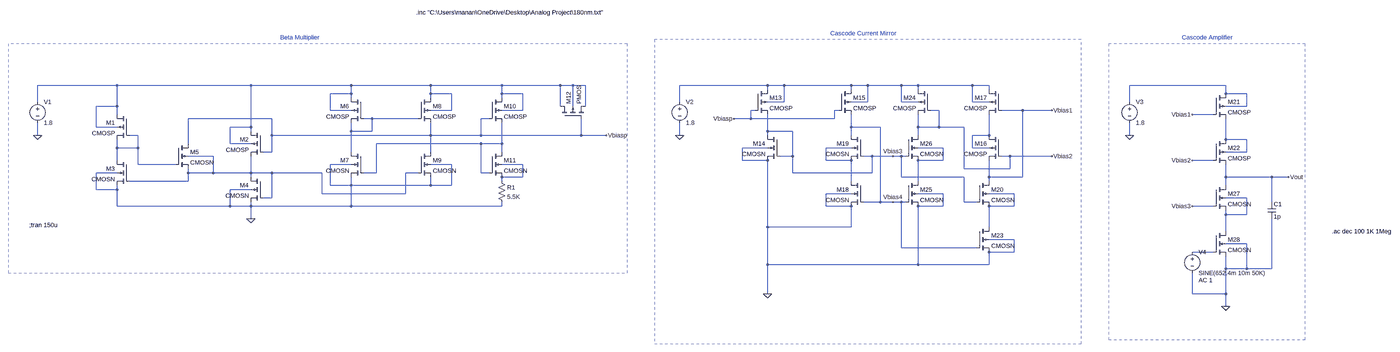
[diagram p0: schematic schematic 180nm.asc, whole sheet]
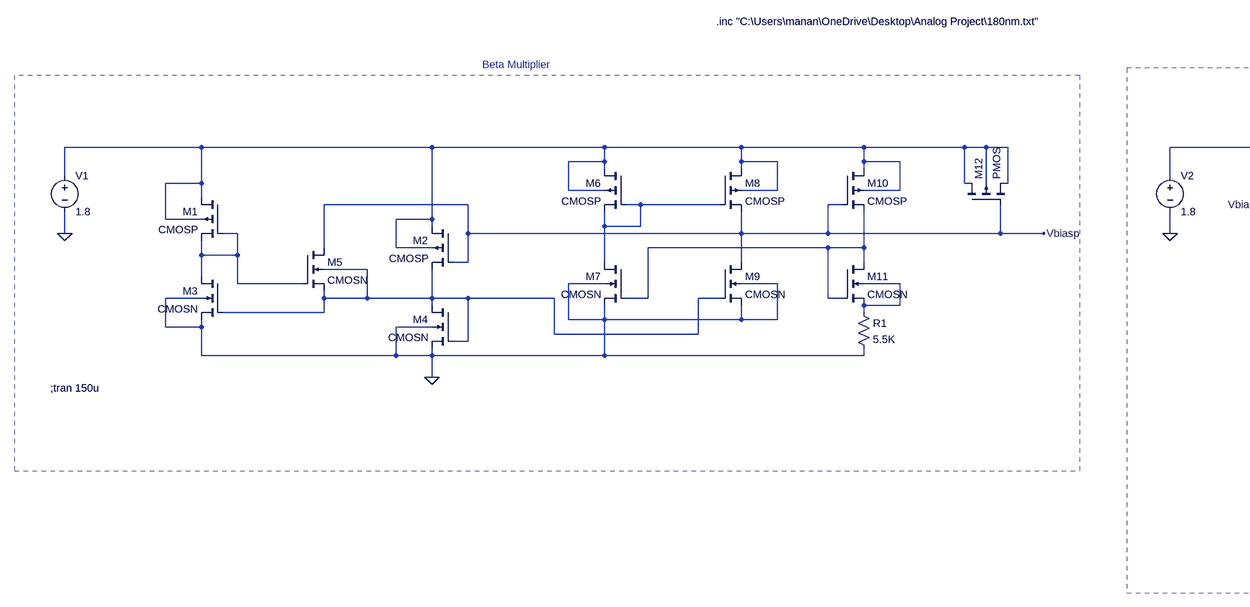
[diagram p1: schematic schematic 180nm.asc, part, row 1 of 1, column 1 of 2]
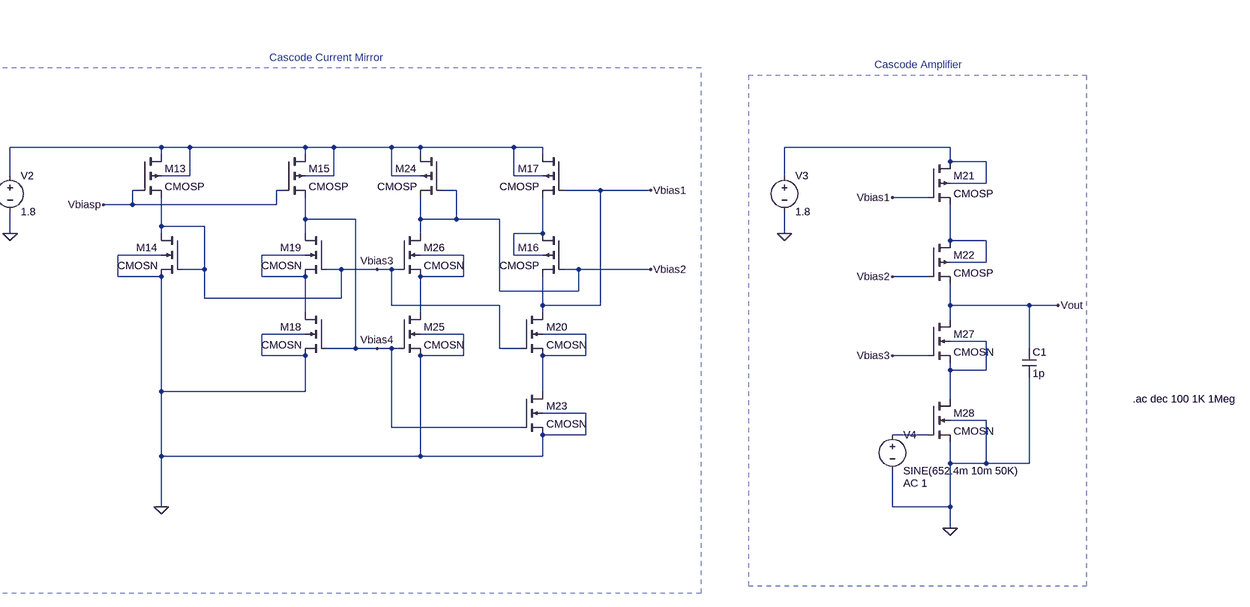
[diagram p2: schematic schematic 180nm.asc, part, row 1 of 1, column 2 of 2]
schematic 180nm.asc, the LTspice schematic file:
Version 4
SHEET 1 5436 1012
WIRE 32 16 -272 16
WIRE 544 16 32 16
WIRE 928 16 544 16
WIRE 1232 16 928 16
WIRE 1504 16 1232 16
WIRE 1728 16 1504 16
WIRE 1776 16 1728 16
WIRE 1824 16 1776 16
WIRE 2784 16 2448 16
WIRE 2848 16 2784 16
WIRE 3104 16 2848 16
WIRE 3168 16 3104 16
WIRE 3296 16 3168 16
WIRE 3360 16 3296 16
WIRE 3568 16 3360 16
WIRE 3632 16 3568 16
WIRE 4704 16 4336 16
WIRE 2784 32 2784 16
WIRE 3104 32 3104 16
WIRE 3360 32 3360 16
WIRE 3632 32 3632 16
WIRE 928 48 928 16
WIRE 928 48 848 48
WIRE 1232 48 1232 16
WIRE 1312 48 1232 48
WIRE 1504 48 1504 16
WIRE 1584 48 1504 48
WIRE 4704 48 4704 16
WIRE 4784 48 4704 48
WIRE 928 64 928 48
WIRE 1232 64 1232 48
WIRE 1504 64 1504 48
WIRE -272 80 -272 16
WIRE 2448 80 2448 16
WIRE 2848 80 2848 16
WIRE 2848 80 2784 80
WIRE 3168 80 3168 16
WIRE 3168 80 3104 80
WIRE 3296 80 3296 16
WIRE 3360 80 3296 80
WIRE 3568 80 3568 16
WIRE 3632 80 3568 80
WIRE 4336 80 4336 16
WIRE 32 96 32 16
WIRE 32 96 -48 96
WIRE 1728 96 1728 16
WIRE 1776 96 1776 16
WIRE 1824 96 1824 16
WIRE 4784 96 4784 48
WIRE 4784 96 4704 96
WIRE 848 112 848 48
WIRE 928 112 848 112
WIRE 1312 112 1312 48
WIRE 1312 112 1232 112
WIRE 1584 112 1584 48
WIRE 1584 112 1504 112
WIRE 2736 112 2720 112
WIRE 3056 112 3040 112
WIRE 3440 112 3408 112
WIRE 3760 112 3680 112
WIRE 3872 112 3760 112
WIRE 32 128 32 96
WIRE 4656 128 4576 128
WIRE 624 144 304 144
WIRE 1008 144 976 144
WIRE 1184 144 1008 144
WIRE 1456 144 1424 144
WIRE 2720 144 2720 112
WIRE 2720 144 2656 144
WIRE 3040 144 3040 112
WIRE 3040 144 2720 144
WIRE -48 176 -48 96
WIRE 32 176 -48 176
WIRE 544 176 544 16
WIRE 544 176 464 176
WIRE 3104 176 3104 128
WIRE 3216 176 3104 176
WIRE 3360 176 3360 128
WIRE 3440 176 3440 112
WIRE 3440 176 3360 176
WIRE 3536 176 3440 176
WIRE 544 192 544 176
WIRE 928 192 928 160
WIRE 1008 192 1008 144
WIRE 1008 192 928 192
WIRE 2784 192 2784 128
WIRE 2880 192 2784 192
WIRE -272 208 -272 160
WIRE 112 208 80 208
WIRE 624 208 624 144
WIRE 1232 208 1232 160
WIRE 1232 208 624 208
WIRE 1424 208 1424 144
WIRE 1424 208 1232 208
WIRE 1808 208 1808 144
WIRE 1808 208 1424 208
WIRE 1904 208 1808 208
WIRE 2448 208 2448 160
WIRE 2784 208 2784 192
WIRE 3104 208 3104 176
WIRE 3360 208 3360 176
WIRE 3632 208 3632 128
WIRE 3632 208 3568 208
WIRE 4336 208 4336 160
WIRE 4704 224 4704 144
WIRE 4784 224 4704 224
WIRE 304 240 304 144
WIRE 464 240 464 176
WIRE 544 240 464 240
WIRE 1424 240 1024 240
WIRE 1504 240 1504 160
WIRE 1504 240 1424 240
WIRE 32 256 32 224
WIRE 112 256 112 208
WIRE 112 256 32 256
WIRE 2784 256 2688 256
WIRE 3104 256 3008 256
WIRE 3456 256 3360 256
WIRE 3568 256 3568 208
WIRE 3632 256 3568 256
WIRE 624 272 624 208
WIRE 624 272 592 272
WIRE 928 272 928 192
WIRE 1232 272 1232 208
WIRE 1504 272 1504 240
WIRE 4784 272 4784 224
WIRE 4784 272 4704 272
WIRE 400 288 304 288
WIRE 2880 288 2880 192
WIRE 2880 288 2832 288
WIRE 3184 288 3152 288
WIRE 3264 288 3184 288
WIRE 3296 288 3264 288
WIRE 3312 288 3296 288
WIRE 3712 288 3680 288
WIRE 3872 288 3712 288
WIRE 32 304 32 256
WIRE 2688 304 2688 256
WIRE 2784 304 2688 304
WIRE 3008 304 3008 256
WIRE 3104 304 3008 304
WIRE 3456 304 3456 256
WIRE 3456 304 3360 304
WIRE 4656 304 4576 304
WIRE 112 320 112 256
WIRE 256 320 112 320
WIRE 928 320 848 320
WIRE 1312 320 1232 320
WIRE 1584 320 1504 320
WIRE 3536 336 3536 176
WIRE 3712 336 3712 288
WIRE 3712 336 3536 336
WIRE 32 352 -48 352
WIRE 304 352 304 336
WIRE 400 352 400 288
WIRE 400 352 304 352
WIRE 544 352 544 288
WIRE 544 352 400 352
WIRE 624 352 544 352
WIRE 816 352 624 352
WIRE 1024 352 1024 240
WIRE 1024 352 976 352
WIRE 1184 352 1136 352
WIRE 1424 352 1424 240
WIRE 1456 352 1424 352
WIRE 2880 352 2880 288
WIRE 3184 352 3184 288
WIRE 3184 352 2880 352
WIRE 544 368 544 352
WIRE 1584 368 1584 320
WIRE 1584 368 1504 368
WIRE 3296 368 3296 288
WIRE 3536 368 3296 368
WIRE 3632 368 3632 304
WIRE 3760 368 3760 112
WIRE 3760 368 3632 368
WIRE 4704 368 4704 320
WIRE 4880 368 4704 368
WIRE 4944 368 4880 368
WIRE 304 384 304 352
WIRE 304 384 80 384
WIRE 1504 384 1504 368
WIRE 3104 384 3104 304
WIRE 3360 384 3360 304
WIRE 3632 384 3632 368
WIRE 848 400 848 320
WIRE 928 400 928 368
WIRE 928 400 848 400
WIRE 1232 400 1232 368
WIRE 1232 400 928 400
WIRE 1312 400 1312 320
WIRE 1312 400 1232 400
WIRE 4704 400 4704 368
WIRE -48 416 -48 352
WIRE 32 416 32 400
WIRE 32 416 -48 416
WIRE 544 416 464 416
WIRE 816 432 816 352
WIRE 1136 432 1136 352
WIRE 1136 432 816 432
WIRE 3104 432 3008 432
WIRE 3456 432 3360 432
WIRE 3728 432 3632 432
WIRE 624 448 624 352
WIRE 624 448 592 448
WIRE 4784 448 4704 448
WIRE 3216 464 3216 176
WIRE 3216 464 3152 464
WIRE 3264 464 3216 464
WIRE 3296 464 3264 464
WIRE 3312 464 3296 464
WIRE 3536 464 3536 368
WIRE 3584 464 3536 464
WIRE 4880 464 4880 368
WIRE 32 480 32 416
WIRE 464 480 464 416
WIRE 464 480 32 480
WIRE 544 480 544 464
WIRE 544 480 464 480
WIRE 928 480 928 400
WIRE 928 480 544 480
WIRE 1504 480 1504 464
WIRE 1504 480 928 480
WIRE 3008 480 3008 432
WIRE 3104 480 3008 480
WIRE 3456 480 3456 432
WIRE 3456 480 3360 480
WIRE 3728 480 3728 432
WIRE 3728 480 3632 480
WIRE 4656 480 4576 480
WIRE 4704 512 4704 496
WIRE 4784 512 4784 448
WIRE 4784 512 4704 512
WIRE 544 528 544 480
WIRE 2784 560 2784 304
WIRE 3104 560 3104 480
WIRE 3104 560 2784 560
WIRE 3632 560 3632 480
WIRE 4704 576 4704 512
WIRE 3728 608 3632 608
WIRE 4784 624 4704 624
WIRE 3296 640 3296 464
WIRE 3584 640 3296 640
WIRE 3728 656 3728 608
WIRE 3728 656 3632 656
WIRE 4656 656 4576 656
WIRE 2784 704 2784 560
WIRE 3360 704 3360 480
WIRE 3360 704 2784 704
WIRE 3632 704 3632 656
WIRE 3632 704 3360 704
WIRE 4704 720 4704 672
WIRE 4784 720 4784 624
WIRE 4784 720 4704 720
WIRE 4880 720 4880 528
WIRE 4880 720 4784 720
WIRE 2784 816 2784 704
WIRE 4576 816 4576 736
WIRE 4704 816 4704 720
WIRE 4704 816 4576 816
WIRE 4704 864 4704 816
FLAG -272 208 0
FLAG 544 528 0
FLAG 1904 208 Vbiasp
FLAG 2448 208 0
FLAG 2784 816 0
FLAG 2656 144 Vbiasp
FLAG 3872 112 Vbias1
FLAG 3872 288 Vbias2
FLAG 3264 288 Vbias3
FLAG 3264 464 Vbias4
FLAG 4336 208 0
FLAG 4704 864 0
FLAG 4576 128 Vbias1
FLAG 4576 304 Vbias2
FLAG 4576 480 Vbias3
FLAG 4944 368 Vout
SYMBOL voltage -272 64 R0
WINDOW 123 0 0 Left 0
WINDOW 39 0 0 Left 0
SYMATTR InstName V1
SYMATTR Value 1.8
SYMBOL nmos4 80 304 M0
SYMATTR InstName M3
SYMATTR Value CMOSN
SYMATTR Value2 l=360n w=1800n
SYMBOL nmos4 592 368 M0
SYMATTR InstName M4
SYMATTR Value CMOSN
SYMATTR Value2 l=360n w=1800n
SYMBOL pmos4 80 128 M0
SYMATTR InstName M1
SYMATTR Value CMOSP
SYMATTR Value2 l=3600n w=1800n
SYMBOL pmos4 592 192 M0
SYMATTR InstName M2
SYMATTR Value CMOSP
SYMATTR Value2 l=360n w=4320n
SYMBOL nmos4 256 240 R0
SYMATTR InstName M5
SYMATTR Value CMOSN
SYMATTR Value2 l=360n w=720n
SYMBOL pmos4 976 64 M0
SYMATTR InstName M6
SYMATTR Value CMOSP
SYMATTR Value2 l=360n w=4320n
SYMBOL nmos4 976 272 M0
SYMATTR InstName M7
SYMATTR Value CMOSN
SYMATTR Value2 l=360n w=1800n
SYMBOL pmos4 1184 64 R0
SYMATTR InstName M8
SYMATTR Value CMOSP
SYMATTR Value2 l=360n w=4320n
SYMBOL nmos4 1184 272 R0
SYMATTR InstName M9
SYMATTR Value CMOSN
SYMATTR Value2 l=360n w=1800n
SYMBOL pmos4 1456 64 R0
SYMATTR InstName M10
SYMATTR Value CMOSP
SYMATTR Value2 l=360n w=4320n
SYMBOL nmos4 1456 272 R0
SYMATTR InstName M11
SYMATTR Value CMOSN
SYMATTR Value2 l=360n w=5400n
SYMBOL res 1488 368 R0
SYMATTR InstName R1
SYMATTR Value 5.5K
SYMBOL pmos4 1728 144 R270
SYMATTR InstName M12
SYMATTR Value2 l=9000n w=9000n
SYMBOL voltage 2448 64 R0
WINDOW 123 0 0 Left 0
WINDOW 39 0 0 Left 0
SYMATTR InstName V2
SYMATTR Value 1.8
SYMBOL pmos4 2736 32 R0
SYMATTR InstName M13
SYMATTR Value CMOSP
SYMATTR Value2 l=360n w=4320n
SYMBOL nmos4 2832 208 M0
SYMATTR InstName M14
SYMATTR Value CMOSN
SYMATTR Value2 l=360n w=900n
SYMBOL pmos4 3056 32 R0
SYMATTR InstName M15
SYMATTR Value CMOSP
SYMATTR Value2 l=360n w=4320n
SYMBOL pmos4 3680 32 M0
SYMATTR InstName M17
SYMATTR Value CMOSP
SYMATTR Value2 l=360n w=4320n
SYMBOL nmos4 3152 384 M0
SYMATTR InstName M18
SYMATTR Value CMOSN
SYMATTR Value2 l=360n w=1800n
SYMBOL nmos4 3152 208 M0
SYMATTR InstName M19
SYMATTR Value CMOSN
SYMATTR Value2 l=360n w=1800n
SYMBOL nmos4 3584 560 R0
SYMATTR InstName M23
SYMATTR Value CMOSN
SYMATTR Value2 l=360n w=1800n
SYMBOL pmos4 3408 32 M0
SYMATTR InstName M24
SYMATTR Value CMOSP
SYMATTR Value2 l=900n w=3600n
SYMBOL nmos4 3312 384 R0
SYMATTR InstName M25
SYMATTR Value CMOSN
SYMATTR Value2 l=360n w=1800n
SYMBOL nmos4 3312 208 R0
SYMATTR InstName M26
SYMATTR Value CMOSN
SYMATTR Value2 l=360n w=1800n
SYMBOL pmos4 3680 208 M0
SYMATTR InstName M16
SYMATTR Value CMOSP
SYMATTR Value2 l=360n w=4320n
SYMBOL nmos4 3584 384 R0
SYMATTR InstName M20
SYMATTR Value CMOSN
SYMATTR Value2 l=360n w=1800n
SYMBOL voltage 4336 64 R0
WINDOW 123 0 0 Left 0
WINDOW 39 0 0 Left 0
SYMATTR InstName V3
SYMATTR Value 1.8
SYMBOL pmos4 4656 48 R0
SYMATTR InstName M21
SYMATTR Value CMOSP
SYMATTR Value2 l=360n w=3960n
SYMBOL pmos4 4656 224 R0
SYMATTR InstName M22
SYMATTR Value CMOSP
SYMATTR Value2 l=360n w=3960n
SYMBOL nmos4 4656 400 R0
SYMATTR InstName M27
SYMATTR Value CMOSN
SYMATTR Value2 l=360n w=1800n
SYMBOL nmos4 4656 576 R0
SYMATTR InstName M28
SYMATTR Value CMOSN
SYMATTR Value2 l=360n w=1800n
SYMBOL cap 4864 464 R0
SYMATTR InstName C1
SYMATTR Value 1p
SYMBOL voltage 4576 640 R0
WINDOW 123 24 124 Left 2
WINDOW 39 0 0 Left 0
SYMATTR Value2 AC 1
SYMATTR InstName V4
SYMATTR Value SINE(652.4m 10m 50K)
TEXT 1176 -264 Left 2 !.inc "C:\\Users\\manan\\OneDrive\\Desktop\\Analog Project\\180nm.txt"
TEXT -304 552 Left 2 !;tran 150u
TEXT 5192 576 Left 2 !.ac dec 100 1K 1Meg
TEXT 656 -168 Left 2 ;Beta Multiplier
TEXT 3024 -184 Left 2 ;Cascode Current Mirror
TEXT 4536 -168 Left 2 ;Cascode Amplifier
RECTANGLE Normal 4256 992 5008 -144 2
RECTANGLE Normal 2352 1008 3984 -160 2
RECTANGLE Normal -384 736 1984 -144 2

The netlist it stands for:
* schematic 180nm.asc
V1 N001 0 1.8
M3 N005 N011 0 0 CMOSN l=360n w=1800n
M4 N011 N011 0 0 CMOSN l=360n w=1800n
M1 N001 N005 N005 N001 CMOSP l=3600n w=1800n
M2 N001 Vbiasp N011 N001 CMOSP l=360n w=4320n
M5 Vbiasp N005 N011 N011 CMOSN l=360n w=720n
M6 N001 N004 N004 N001 CMOSP l=360n w=4320n
M7 N004 N008 0 0 CMOSN l=360n w=1800n
M8 N001 N004 Vbiasp N001 CMOSP l=360n w=4320n
M9 Vbiasp N011 0 0 CMOSN l=360n w=1800n
M10 N001 Vbiasp N008 N001 CMOSP l=360n w=4320n
M11 N008 N008 N012 N012 CMOSN l=360n w=5400n
R1 N012 0 5.5K
M12 N001 Vbiasp N001 N001 PMOS l=9000n w=9000n
V2 N002 0 1.8
M13 N002 Vbiasp Vbias3 N002 CMOSP l=360n w=4320n
M14 Vbias3 Vbias3 0 0 CMOSN l=360n w=900n
M15 N002 Vbiasp Vbias4 N002 CMOSP l=360n w=4320n
M17 N002 Vbias1 N006 N002 CMOSP l=360n w=4320n
M18 N009 Vbias4 0 0 CMOSN l=360n w=1800n
M19 Vbias4 Vbias3 N009 N009 CMOSN l=360n w=1800n
M23 N013 Vbias4 0 0 CMOSN l=360n w=1800n
M24 N002 Vbias2 Vbias2 N002 CMOSP l=900n w=3600n
M25 N010 Vbias4 0 0 CMOSN l=360n w=1800n
M26 Vbias2 Vbias3 N010 N010 CMOSN l=360n w=1800n
M16 N006 Vbias2 Vbias1 N006 CMOSP l=360n w=4320n
M20 Vbias1 Vbias3 N013 N013 CMOSN l=360n w=1800n
V3 N003 0 1.8
M21 N003 Vbias1 N007 N003 CMOSP l=360n w=3960n
M22 N007 Vbias2 Vout N007 CMOSP l=360n w=3960n
M27 Vout Vbias3 N014 N014 CMOSN l=360n w=1800n
M28 N014 N015 0 0 CMOSN l=360n w=1800n
C1 Vout 0 1p
V4 N015 0 SINE(652.4m 10m 50K) AC 1
.model NMOS NMOS
.model PMOS PMOS
.lib standard.mos
.inc "C:\Users\manan\OneDrive\Desktop\Analog Project\180nm.txt"
;tran 150u
.ac dec 100 1K 1Meg
* Beta Multiplier
* Cascode Current Mirror
* Cascode Amplifier
.backanno
.end